# Altium project EjemploLunes.PrjPcb
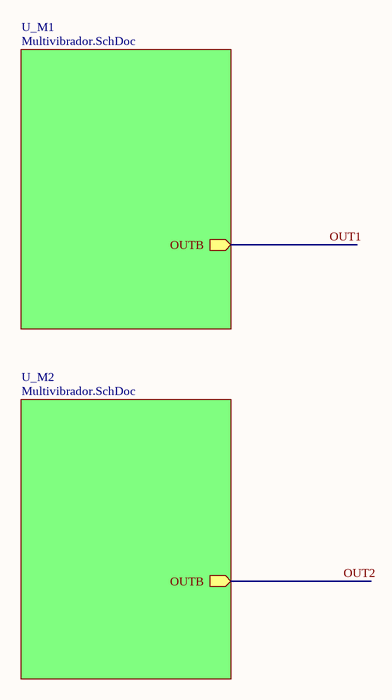
[diagram p0: TOP_MULTI.SchDoc]
2 sheets, 18 parts. Net scope: hierarchical (ports join the sheet entries above them; power ports are global).
Board file: Multiç.PcbDoc
Sheets:
  TOP_MULTI.SchDoc
    U_M1 = Multivibrador.SchDoc
    U_M2 = Multivibrador.SchDoc

## Sheet TOP_MULTI.SchDoc
size A; SheetNumber: 1; SheetTotal: 2

### Sub-sheets
U_M1 = Multivibrador.SchDoc: OUTB (out)
U_M2 = Multivibrador.SchDoc: OUTB (out)

## Sheet Multivibrador.SchDoc
size A; SheetNumber: 2; SheetTotal: 2
Used 2 times, as channels U_M1, U_M2. Parts and nets are listed once, with the designators drawn on the sheet.
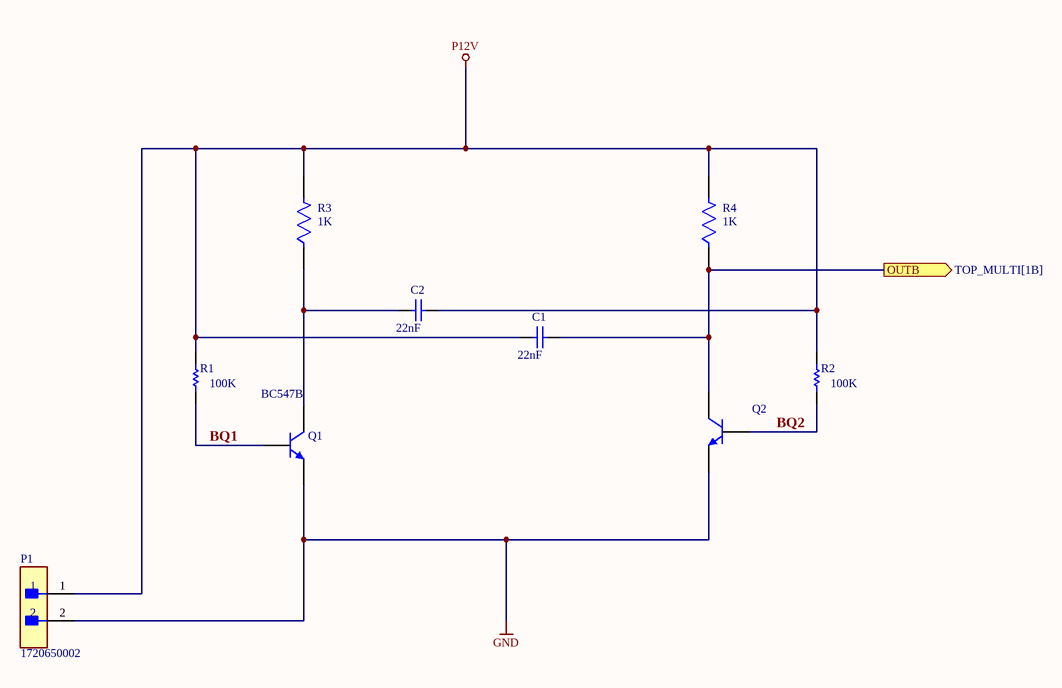
[diagram p1: Multivibrador.SchDoc]

### Parts
C1  value 22nF  [CAPC1608X90X35ML10T15]  (hidden comment: GRM188R71H223KA01D)
C2  value 22nF  [CAPC1608X90X35ML10T15]  (hidden comment: GRM188R71H223KA01D)
P1  1720650002  [FP-1720650002-MFG]
Q1  BC547B  [ONSC-TO-92-3-29-11]
Q2  BC547B  [ONSC-TO-92-3-29-11]  (value not drawn)
R1  value 100K  [RESC2013X50X30NL20T20]  (hidden comment: CRCW0805100KJNEA)
R2  value 100K  [RESC2013X50X30NL20T20]  (hidden comment: CRCW0805100KJNEA)
R3  value 1K  [FP-ESR03-MFG]  (hidden comment: ESR03EZPJ102)
R4  value 1K  [FP-ESR03-MFG]  (hidden comment: ESR03EZPJ102)

### Ports
OUTB (out, see TOP_MULTI[1B])

### Nets
GND: P1.2 Q1.3(E) Q2.3(E)
P12V: C1.2 C2.1 P1.1 R1.2 R2.2 R3.2 R4.2
BQ1: Q1.2(B) R1.1
BQ2: Q2.2(B) R2.1
OUTB: C1.1 Q2.1(C) R4.1 ; port OUTB
NetC2_2: C2.2 Q1.1(C) R3.1

### Channels
U_M1: designators end in _U_M1; ports OUTB=OUT1
U_M2: designators end in _U_M2; ports OUTB=OUT2

### Library data of the parts
C1 C2 = CMP-2006-02910-1: Manufacturer: Murata; Part Number: GRM188R71H223KA01D
P1 = CMP-04776-000097-1: CONN HEADER VERT 2POS; Manufacturer: Molex; Pitch: 5.7mm; Description: CONNECTOR, HEADER, 2POS, 2ROW; Conn Orientation: Vertical; Number Of Contacts: 2; Current Rating: 23A; Conn Gender: Male; Voltage Rating: 600V; Device Class L1: Connectors; Package: 1720650002; Device Class L3: unset; Category: Conn; RoHS: TRUE; Mouser Description: Headers & Wire Housings Mega-Fit Vert Hdr Assy 2 ckt 15u Au; ComponentLink2URL: http://www.molex.com/webdocs/datasheets/pdf/en-us/1720650002_PCB_HEADERS.pdf; Digikey Description: CONN HEADER VERT 2POS; Lead Free: Yes; Temperature Range High: +120°C; Contact Material: Gold,Nickel; Temperature Range Low: -40°C; Automotive: No; Device Class L2: Headers and Wire Housings; Octopart: https://octopart.com/172065-0002-molex-34473111; Temperature: -40°C to +120°C; ComponentLink2Description: Datasheet; Height: 15.05mm; Footprint Url: https://www.molex.com/pdm_docs/sd/1720650002_sd.pdf; Number Of Rows: 2; Manufacturer Part Number: 1720650002
Q1 Q2 = CMP-1048-01467-1: Amplifier Transistor, NPN Silicon, 3-Pin TO-92, Bulk Box; Manufacturer: On Semiconductor; IC Continuous (A): 0.1; fT Min (MHz): 150; Description: Trans GP BJT NPN 45V 0.1A 500mW Automotive 3-Pin TO-92 Ammo; Collector Emitter Voltage (VCEO): 45V; Max Power Dissipation: 500mW; Max Collector Current: 100mA; Collector Base Voltage (VCBO): 50V; Emitter Base Voltage (VEBO): 6V; Element Configuration: Single; Number of Elements: 1; hFE Min: 200; Frequency: 300MHz; Collector Emitter Saturation Voltage: 300mV; Gain Bandwidth Product: 100MHz; Voltage: 40V; DatasheetVersion: Rev. 7; ComponentLink1URL: http://www.onsemi.com/; Polarity: NPN; RoHS: FALSE; ComponentLink1Description: Manufacturer URL; Packing: Bulk Box; PackageDescription: 3-Pin Transistor Outline, Body 4.825 x 3.685 mm, Pitch 1.27 mm; ComponentLink3URL: http://www.onsemi.cn/pub_link/Collateral/2N6426-D.PDF; ComponentLink2Description: Datasheet; PackageVersion: Rev. AM; PackageReference: TO-92-3-29-11_AM_SL; ComponentLink3Description: Package Specification; Mounting Technology: Through Hole; PartNumber: BC547B; ComponentLink2URL: http://www.onsemi.com/pub_link/Collateral/BC546-D.PDF; Supplier 1: Arrow Electronics; Supplier Part Number 1: BC547B; Manufacturer Part Number: BC547B; Category: BJTs; Stock 1: 14330; Mount: Through Hole; Case/Package: TO-92; Number of Pins: 3; Weight: 0.007055oz; Contact Plating: Copper,Tin,Silver; Min Operating Temperature: -65°C; Max Operating Temperature: 150°C; Packaging: Bulk; Power Dissipation: 500mW; Voltage Rating (DC): 45V; Current Rating: 100mA; Package Quantity: 2000; Collector Emitter Breakdown Voltage: 45V; Transition Frequency: 300MHz; Max Frequency: 300MHz; Max Breakdown Voltage: 45V; Length: 4.58mm; Width: 3.86mm; Height: 4.58mm; Radiation Hardening: No; Lead Free: Lead Free; REACH SVHC: No SVHC; ComponentLink4URL: https://datasheet.ciiva.com/17011/bc547-17011404.pdf?src-supplier=Future+Electronics; ComponentLink4Description: https://datasheet.ciiva.com/17011/bc547-17011404.pdf?src-supplier=Future+Electronics; ComponentLink5URL: https://datasheet.ciiva.com/985/bc546-547-548rev5-985523.pdf?src-supplier=Digi-Key; ComponentLink5Description: https://datasheet.ciiva.com/985/bc546-547-548rev5-985523.pdf?src-supplier=Digi-Key; ComponentLink6URL: https://datasheet.ciiva.com/972/bc546-972262.pdf?src-supplier=Digi-Key; ComponentLink6Description: https://datasheet.ciiva.com/972/bc546-972262.pdf?src-supplier=Digi-Key; ComponentLink7URL: https://datasheet.ciiva.com/1195/1868820-1195464.pdf?src-supplier=Element14; ComponentLink7Description: https://datasheet.ciiva.com/1195/1868820-1195464.pdf?src-supplier=Element14; ComponentLink8URL: https://datasheet.ciiva.com/11197/bc550-11197769.pdf?src-supplier=Avnet; ComponentLink8Description: https://datasheet.ciiva.com/11197/bc550-11197769.pdf?src-supplier=Avnet
R1 R2 = CMP-2001-04900-1: Manufacturer: Vishay Dale; Part Number: CRCW0805100KJNEA
R3 R4 = CMP-08839-028118-1: 1kΩ ±5% 0.25W 0603 Anti-Surge Chip Resistor AEC-Q200; Max Power Dissipation: 250mW; Temperature Coefficient: 200ppm/°C; Packaging: Tape and Reel; Number of Terminations: 2; Series: ESR; Features: Automotive AEC-Q200; Case Code (Metric): 1608; Tolerance: 5%; Package Quantity: 1; Length: 0.063inch; Max Operating Temperature: 155°C; Case Code (Imperial): 0603; RoHS Compliant: Yes; Resistor Type: Thick Film; Width: 0.031inch; Height: 0.022inch; Case/Package: 0603; Min Operating Temperature: -55°C; Lead Free: Lead Free

## Nets that join several sheets
GND: U_M1 (P1_U_M1.2 Q1_U_M1.3 Q2_U_M1.3), U_M2 (P1_U_M2.2 Q1_U_M2.3 Q2_U_M2.3)
P12V: U_M1 (7 pins), U_M2 (7 pins)